# Altium project BAI2.PrjPcb
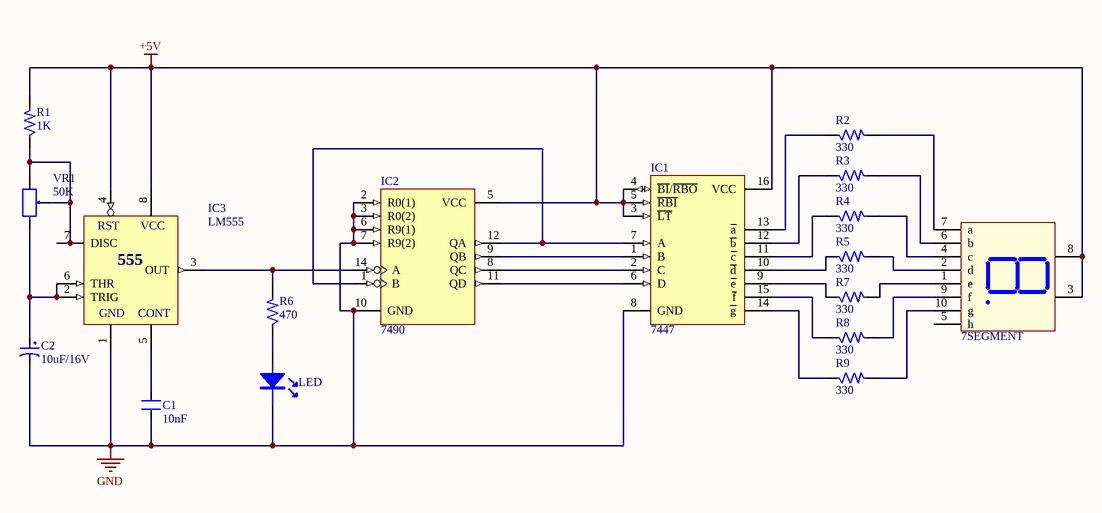
[diagram p0: BAI2.SchDoc]
1 sheet, 17 parts. Net scope: global (net labels, ports and power ports of the same name join across sheets).

## Sheet BAI2.SchDoc
size A; SheetNumber: 1; SheetTotal: 1

### Parts
C1  10nF  [SM-0805]
C2  10uF/16V  [CP1/2]
D?  LED  [CAP10UF]
DS?  7SEGMENT  [7SEGS]
IC1  7447  [DIP16]
IC2  7490  [DIP14]
IC3  LM555  [DIP8]
R1  1K  [R1/6W]
R2  330  [R1/6W]
R3  330  [R1/6W]
R4  330  [R1/6W]
R5  330  [R1/6W]
R6  470  [R1/6W]
R7  330  [R1/6W]
R8  330  [R1/6W]
R9  330  [R1/6W]
VR1  50K  [VOL_1]

### Nets
+5V: DS?.3(Vcc) DS?.8(Vcc) IC1.3(~{LT}) IC1.4(~{BI}/~{RBO}) IC1.5(~{RBI}) IC1.16(VCC) IC2.5(VCC) IC3.4(RST) IC3.8(VCC) R1.2
GND: C1.1 C2.2 D?.2 IC1.8(GND) IC2.2(R0(1)) IC2.3(R0(2)) IC2.6(R9(1)) IC2.7(R9(2)) IC2.10(GND) IC3.1(GND)
NetC1_2: C1.2 IC3.5(CONT)
NetC2_1: C2.1 IC3.2(TRIG) IC3.6(THR) VR1.3
NetD?_1: D?.1 R6.1
NetDS?_1: DS?.1(e) R7.2
NetDS?_2: DS?.2(d) R5.2
NetDS?_4: DS?.4(c) R4.2
NetDS?_6: DS?.6(b) R3.2
NetDS?_7: DS?.7(a) R2.2
NetDS?_9: DS?.9(f) R8.2
NetDS?_10: DS?.10(g) R9.2
NetIC1_1: IC1.1(B) IC2.9(QB)
NetIC1_2: IC1.2(C) IC2.8(QC)
NetIC1_6: IC1.6(D) IC2.11(QD)
NetIC1_7: IC1.7(A) IC2.1(B) IC2.12(QA)
NetIC1_9: IC1.9(~{e}) R7.1
NetIC1_10: IC1.10(~{d}) R5.1
NetIC1_11: IC1.11(~{c}) R4.1
NetIC1_12: IC1.12(~{b}) R3.1
NetIC1_13: IC1.13(~{a}) R2.1
NetIC1_14: IC1.14(~{g}) R9.1
NetIC1_15: IC1.15(~{f}) R8.1
NetIC2_14: IC2.14(A) IC3.3(OUT) R6.2
NetIC3_7: IC3.7(DISC) R1.1 VR1.1 VR1.2

Not connected (* = marked no-connect by the designer): DS? 5(h)

### Notes on the sheet
- (in symbol LM555) 555

### Library data of the parts
C1 = CM: Cap SMD; Value: 103
C2 = CP1: Cap P  0,1uF < 22uF , 16 - 50V; Value: 10uF/50V; Description 1: 10 => 220uF/6,3V/10V - 10uF => 100uF/16V; Description 2: 0,1uF => 33uF/50V - 10uF => 22uF/63V; Description 3: 0,47uF => 10uF/100V
DS? = LED7S: Single 7 Seg Dipslay; Value: LED 7S SEG
IC1 = 7447: BCD to 7-Segment Decoder/Driver; Value: 7447 , 74247
IC2 = 7490: 4-Bit Decade Counter; Value: 7490
IC3 = LM555: Timer Circuits; Value: LM555
R1-R9 = Res: Resistor 1/4W; Value: R1/4W - 1K
VR1 = Var Resitor: Var Resistor; Value: VR 10K